# Altium schematic sheet MAZ000160 - Diagrama físico.SchDoc: MAZ000160 - Diagrama físico
size A; ApprovedBy: Christian Ledwidth; CheckedBy: Nahuel Martinez; Author: Santiago Marti; CompanyName: Body Health; DrawnBy: Santiago Marti; Revision: A; SheetNumber: 2; SheetTotal: 2
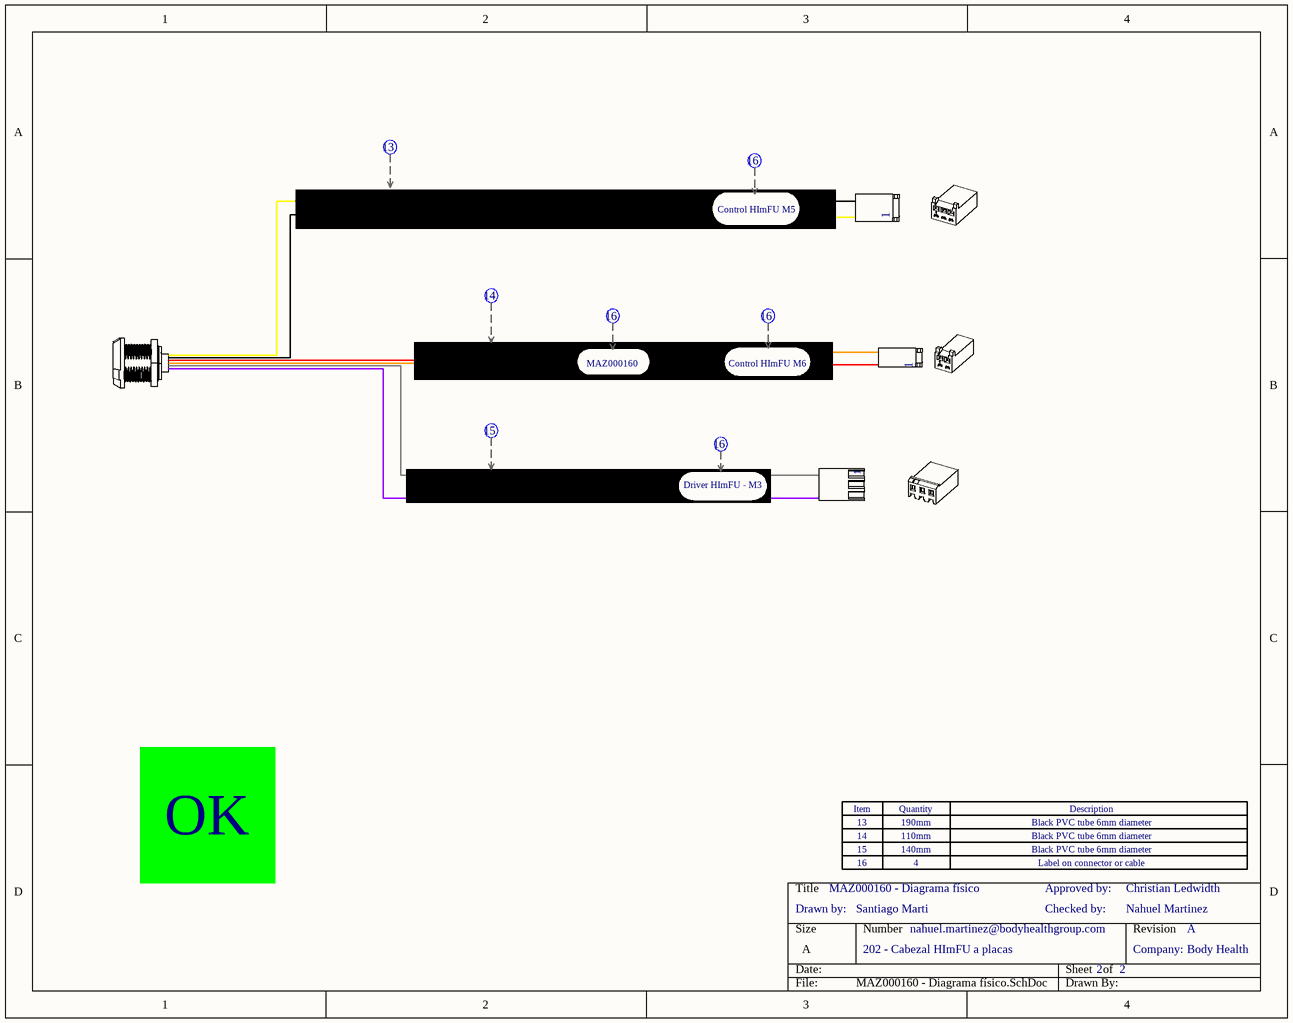
[diagram p0: MAZ000160 - Diagrama físico.SchDoc]

## Parts
Cab1  Cable  (value not drawn)
Cab3  Cable  (value not drawn)
Cab4  Cable  (value not drawn)
Cab5  Cable  (value not drawn)
Cab6  Cable  (value not drawn)
Cab7  Cable  (value not drawn)
Cab9  Cable  (value not drawn)
Con1  CST-100-3  (value not drawn)  (parts A,B of 4)
Con2  CST-100-2  (value not drawn)  (parts A,B of 4)
Con3  SL156-3  (value not drawn)  (parts A,B of 4)
Conn1  SZCNT_08_Hembra  (value not drawn)  (part A of 3)
Zoc1  Zócalo_Header  (value not drawn)
Zoc2  Zócalo_Item  (value not drawn)
Zoc3  Zócalo_Item  (value not drawn)
Zoc4  Zócalo_Item  (value not drawn)
Zoc5  Zócalo_Item  (value not drawn)

## Notes on the sheet
- (near Cab3) Control HImFU M5
- (near Cab6) MAZ000160
- (near Cab4) Control HImFU M6
- (near Cab9) Driver HImFU - M3
- OK
- 13
- 14
- 190mm
- 110mm
- Black PVC tube 6mm diameter
- Drawn by:
- 15
- 16
- 140mm
- 4
- Checked by:
- Approved by:
- Label on connector or cable
- 202 - Cabezal HImFU a placas
- nahuel.martinez@bodyhealthgroup.com
- Company:
- (in symbol Zócalo_Header) Item; Quantity; Description

## Library data of the parts
Cab1 = Cable: CallOut: 13; Largo: *mm; Sección: *mm2; Color: *
Cab3 Cab4 Cab6 Cab9 = Cable: CallOut: 16; Largo: *mm; Sección: *mm2; Color: *
Cab5 = Cable: CallOut: 14; Largo: *mm; Sección: *mm2; Color: *
Cab7 = Cable: CallOut: 15; Largo: *mm; Sección: *mm2; Color: *
Con1 = CST-100-3: CONN RCPT HSNG 3POS CST-100 II; Cod.Fabricante: 1375820-3; Fabricante: TE Connectivity AMP Connectors; Cod.DigiKey: A99614-ND; ComponentLink1Description: Manufacturer Link; ComponentLink1URL: https://www.te.com/commerce/DocumentDelivery/DDEController?Action=srchrtrv&DocNm=1375820&DocType=Customer+Drawing&DocLang=English; DIGIKEYx50: 0.12620; CallOut: *; DIGIKEYx100: 0.11720
Con2 = CST-100-2: CONN RCPT HSNG 2POS CST-100 II; Cod.Fabricante: 1375820-2; Fabricante: TE Connectivity AMP Connectors; Cod.DigiKey: A99613-ND; ComponentLink1Description: Manufacturer Link; ComponentLink1URL: https://www.te.com/commerce/DocumentDelivery/DDEController?Action=srchrtrv&DocNm=1375820&DocType=Customer+Drawing&DocLang=English; DIGIKEYx50: 0.08380; CallOut: *; DIGIKEYx100: NO
Con3 = SL156-3: CONN RECEPT 3 POS W/RAMP SL-156; Cod.Fabricante: 640250-3; Fabricante: TE Connectivity AMP Connectors; Cod.DigiKey: A19951-ND; ComponentLink1Description: Manufacturer Link; ComponentLink1URL: https://www.te.com/commerce/DocumentDelivery/DDEController?Action=srchrtrv&DocNm=640250&DocType=Customer+Drawing&DocLang=English; DIGIKEYx50: 0.14460; CallOut: *; DIGIKEYx100: 0.13430
Conn1 = SZCNT_08_Hembra: Conector SZCNT 8 vías hembra para gabinete; Cod.DigiKey: Se compra a SZCNT; Cod.Fabricante: *; ComponentLink1Description: Manufacturer Link; ComponentLink1URL: *; DIGIKEYx100: *; Fabricante: SZCNT; CallOut: *; DIGIKEYx50: *
Zoc1 = Zócalo_Header: Header para el zócalo de referencias
Zoc2-Zoc5 = Zócalo_Item: Ítem para el zócalo de referencias; Desginator: *; Quantity: *; ItemDescription: *